# Altium schematic sheet MCU009B_ADC.SchDoc: ADC
size 431 x 279 mm; Date: Not shown in title block; ApprovedBy: Not shown in title block; CheckedBy: Not shown in title block; Author: Not shown in title block; CompanyName: Not shown in title block; Engineer: Not shown in title block; Organization: Not shown in title block; Address1: Not shown in title block; Address2: Not shown in title block; Address3: Not shown in title block; Address4: Not shown in title block; DocumentNumber: 4; Revision: Use project parameter SCH_Rev; SheetNumber: 4; SheetTotal: 7; PageSetup: Record=PageOptions|CenterHorizontal=True|CenterVertical=True|PrintScale=1.00|XCorrection=1.00|YCorrection=1.00|PrintKind=0|BorderSize=5000000|LeftOffset=0|BottomOffset=0|Orientation=2|PaperLength=1000|PaperWidth=1000|Scale=100|PaperSource=15|PrintQuality=600|MediaType=1|DitherType=10|PaperKind=Letter|PrintScaleMode=1; CurrentTime: Not shown in title block; CurrentDate: Not shown in title block; Time: Not shown in title block; DocumentFullPathAndName: Not shown in title block; DocumentName: Not shown in title block; ModifiedDate: Not shown in title block; ImagePath: Not shown in title block
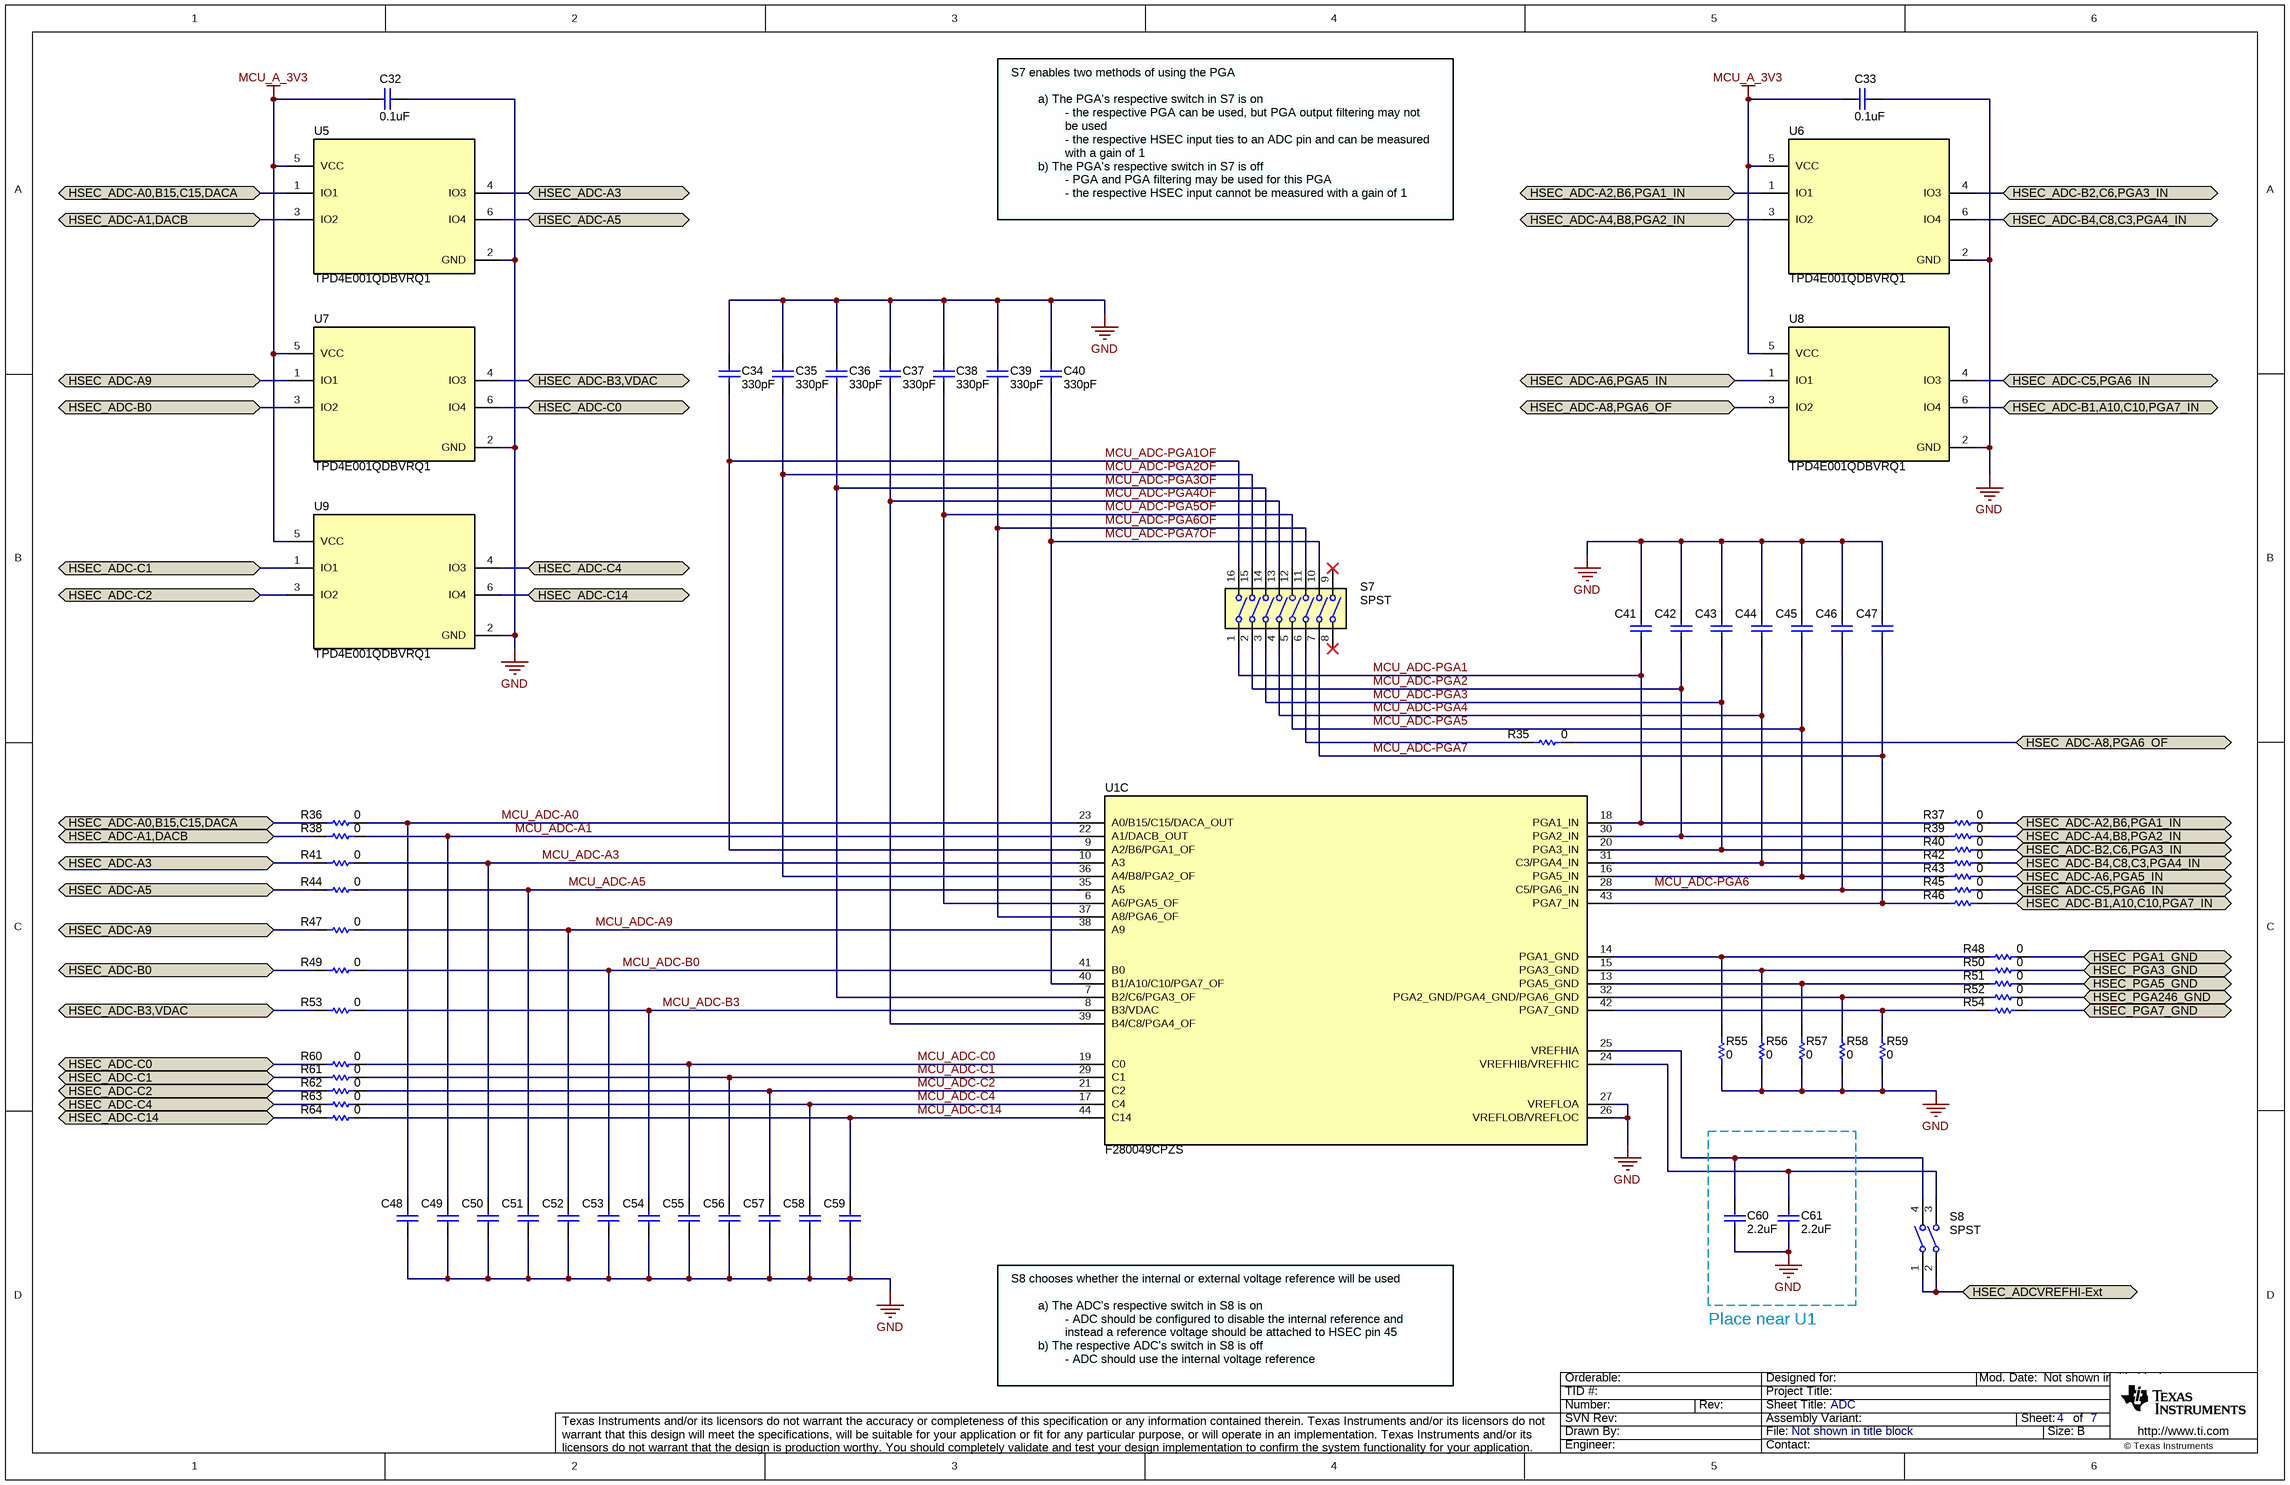
[diagram p0: MCU009B_ADC.SchDoc]

## Parts
C32  ValueDisplayed: 0.1uF  [0402]  (hidden comment: GRM155R71A104KA01D)
C33  ValueDisplayed: 0.1uF  [0402]  (hidden comment: GRM155R71A104KA01D)
C34  ValueDisplayed: 330pF  [0603]  (hidden comment: GRM1885C1H331JA01D)
C35  ValueDisplayed: 330pF  [0603]  (hidden comment: GRM1885C1H331JA01D)
C36  ValueDisplayed: 330pF  [0603]  (hidden comment: GRM1885C1H331JA01D)
C37  ValueDisplayed: 330pF  [0603]  (hidden comment: GRM1885C1H331JA01D)
C38  ValueDisplayed: 330pF  [0603]  (hidden comment: GRM1885C1H331JA01D)
C39  ValueDisplayed: 330pF  [0603]  (hidden comment: GRM1885C1H331JA01D)
C40  ValueDisplayed: 330pF  [0603]  (hidden comment: GRM1885C1H331JA01D)
C41  GRM188R71C104KA01D  [0603]  (value not drawn)
C42  GRM188R71C104KA01D  [0603]  (value not drawn)
C43  GRM188R71C104KA01D  [0603]  (value not drawn)
C44  GRM188R71C104KA01D  [0603]  (value not drawn)
C45  GRM188R71C104KA01D  [0603]  (value not drawn)
C46  GRM188R71C104KA01D  [0603]  (value not drawn)
C47  GRM188R71C104KA01D  [0603]  (value not drawn)
C48  GRM188R71C104KA01D  [0603]  (value not drawn)
C49  GRM188R71C104KA01D  [0603]  (value not drawn)
C50  GRM188R71C104KA01D  [0603]  (value not drawn)
C51  GRM188R71C104KA01D  [0603]  (value not drawn)
C52  GRM188R71C104KA01D  [0603]  (value not drawn)
C53  GRM188R71C104KA01D  [0603]  (value not drawn)
C54  GRM188R71C104KA01D  [0603]  (value not drawn)
C55  GRM188R71C104KA01D  [0603]  (value not drawn)
C56  GRM188R71C104KA01D  [0603]  (value not drawn)
C57  GRM188R71C104KA01D  [0603]  (value not drawn)
C58  GRM188R71C104KA01D  [0603]  (value not drawn)
C59  GRM188R71C104KA01D  [0603]  (value not drawn)
C60  ValueDisplayed: 2.2uF  [0603]  (hidden comment: GRM188R61A225KE34D)
C61  ValueDisplayed: 2.2uF  [0603]  (hidden comment: GRM188R61A225KE34D)
R35  ValueDisplayed: 0  [0603]  (hidden comment: CRCW06030000Z0EA)
R36  ValueDisplayed: 0  [0603]  (hidden comment: CRCW06030000Z0EA)
R37  ValueDisplayed: 0  [0603]  (hidden comment: CRCW06030000Z0EA)
R38  ValueDisplayed: 0  [0603]  (hidden comment: CRCW06030000Z0EA)
R39  ValueDisplayed: 0  [0603]  (hidden comment: CRCW06030000Z0EA)
R40  ValueDisplayed: 0  [0603]  (hidden comment: CRCW06030000Z0EA)
R41  ValueDisplayed: 0  [0603]  (hidden comment: CRCW06030000Z0EA)
R42  ValueDisplayed: 0  [0603]  (hidden comment: CRCW06030000Z0EA)
R43  ValueDisplayed: 0  [0603]  (hidden comment: CRCW06030000Z0EA)
R44  ValueDisplayed: 0  [0603]  (hidden comment: CRCW06030000Z0EA)
R45  ValueDisplayed: 0  [0603]  (hidden comment: CRCW06030000Z0EA)
R46  ValueDisplayed: 0  [0603]  (hidden comment: CRCW06030000Z0EA)
R47  ValueDisplayed: 0  [0603]  (hidden comment: CRCW06030000Z0EA)
R48  ValueDisplayed: 0  [0603]  (hidden comment: CRCW06030000Z0EA)
R49  ValueDisplayed: 0  [0603]  (hidden comment: CRCW06030000Z0EA)
R50  ValueDisplayed: 0  [0603]  (hidden comment: CRCW06030000Z0EA)
R51  ValueDisplayed: 0  [0603]  (hidden comment: CRCW06030000Z0EA)
R52  ValueDisplayed: 0  [0603]  (hidden comment: CRCW06030000Z0EA)
R53  ValueDisplayed: 0  [0603]  (hidden comment: CRCW06030000Z0EA)
R54  ValueDisplayed: 0  [0603]  (hidden comment: CRCW06030000Z0EA)
R55  ValueDisplayed: 0  [0603]  (hidden comment: CRCW06030000Z0EA)
R56  ValueDisplayed: 0  [0603]  (hidden comment: CRCW06030000Z0EA)
R57  ValueDisplayed: 0  [0603]  (hidden comment: CRCW06030000Z0EA)
R58  ValueDisplayed: 0  [0603]  (hidden comment: CRCW06030000Z0EA)
R59  ValueDisplayed: 0  [0603]  (hidden comment: CRCW06030000Z0EA)
R60  ValueDisplayed: 0  [0603]  (hidden comment: CRCW06030000Z0EA)
R61  ValueDisplayed: 0  [0603]  (hidden comment: CRCW06030000Z0EA)
R62  ValueDisplayed: 0  [0603]  (hidden comment: CRCW06030000Z0EA)
R63  ValueDisplayed: 0  [0603]  (hidden comment: CRCW06030000Z0EA)
R64  ValueDisplayed: 0  [0603]  (hidden comment: CRCW06030000Z0EA)
S7  Circuit: SPST  [SW_218-8LP]  (hidden comment: 218-8LPST)
S8  Circuit: SPST  [SW_218-2LP]  (hidden comment: 218-2LPST)
U1  F280049CPZS  [PZ0100A_N]  (part C of 5)
U5  TPD4E001QDBVRQ1  [DBV0006A_N]
U6  TPD4E001QDBVRQ1  [DBV0006A_N]
U7  TPD4E001QDBVRQ1  [DBV0006A_N]
U8  TPD4E001QDBVRQ1  [DBV0006A_N]
U9  TPD4E001QDBVRQ1  [DBV0006A_N]

## Ports
HSEC_ADC-A0,B15,C15,DACA (bidir), HSEC_ADC-A1,DACB (bidir), HSEC_ADC-A2,B6,PGA1_IN (bidir), HSEC_ADC-A3 (bidir), HSEC_ADC-A4,B8,PGA2_IN (bidir), HSEC_ADC-A5 (bidir), HSEC_ADC-A6,PGA5_IN (bidir), HSEC_ADC-A8,PGA6_OF (bidir), HSEC_ADC-A9 (bidir), HSEC_ADC-B0 (bidir), HSEC_ADC-B1,A10,C10,PGA7_IN (bidir), HSEC_ADC-B2,C6,PGA3_IN (bidir), HSEC_ADC-B3,VDAC (bidir), HSEC_ADC-B4,C8,C3,PGA4_IN (bidir), HSEC_ADC-C0 (bidir), HSEC_ADC-C1 (bidir), HSEC_ADC-C2 (bidir), HSEC_ADC-C4 (bidir), HSEC_ADC-C5,PGA6_IN (bidir), HSEC_ADC-C14 (bidir), HSEC_ADCVREFHI-Ext (bidir), HSEC_PGA1_GND (bidir), HSEC_PGA3_GND (bidir), HSEC_PGA5_GND (bidir), HSEC_PGA7_GND (bidir), HSEC_PGA246_GND (bidir)

## Nets
GND: C32.2 C33.2 C34.1 C35.1 C36.1 C37.1 C38.1 C39.1 C40.1 C41.1 C42.1 C43.1 C44.1 C45.1 C46.1 C47.1 C48.2 C49.2 C50.2 C51.2 C52.2 C53.2 C54.2 C55.2 C56.2 C57.2 C58.2 C59.2 C60.1 C61.1 R55.1 R56.1 R57.1 R58.1 R59.1 U1.26(VREFLOB/VREFLOC) U1.27(VREFLOA) U5.2(GND) U6.2(GND) U7.2(GND) U8.2(GND) U9.2(GND)
MCU_A_3V3: C32.1 C33.1 U5.5(VCC) U6.5(VCC) U7.5(VCC) U8.5(VCC) U9.5(VCC)
HSEC_ADC-A0,B15,C15,DACA: R36.2 U5.1(IO1) ; port HSEC_ADC-A0,B15,C15,DACA
HSEC_ADC-A1,DACB: R38.2 U5.3(IO2) ; port HSEC_ADC-A1,DACB
HSEC_ADC-A2,B6,PGA1_IN: R37.1 U6.1(IO1) ; port HSEC_ADC-A2,B6,PGA1_IN
HSEC_ADC-A3: R41.2 U5.4(IO3) ; port HSEC_ADC-A3
HSEC_ADC-A4,B8,PGA2_IN: R39.1 U6.3(IO2) ; port HSEC_ADC-A4,B8,PGA2_IN
HSEC_ADC-A5: R44.2 U5.6(IO4) ; port HSEC_ADC-A5
HSEC_ADC-A6,PGA5_IN: R43.1 U8.1(IO1) ; port HSEC_ADC-A6,PGA5_IN
HSEC_ADC-A8,PGA6_OF: R35.1 U8.3(IO2) ; port HSEC_ADC-A8,PGA6_OF
HSEC_ADC-A9: R47.2 U7.1(IO1) ; port HSEC_ADC-A9
HSEC_ADC-B0: R49.2 U7.3(IO2) ; port HSEC_ADC-B0
HSEC_ADC-B1,A10,C10,PGA7_IN: R46.1 U8.6(IO4) ; port HSEC_ADC-B1,A10,C10,PGA7_IN
HSEC_ADC-B2,C6,PGA3_IN: R40.1 U6.4(IO3) ; port HSEC_ADC-B2,C6,PGA3_IN
HSEC_ADC-B3,VDAC: R53.2 U7.4(IO3) ; port HSEC_ADC-B3,VDAC
HSEC_ADC-B4,C8,C3,PGA4_IN: R42.1 U6.6(IO4) ; port HSEC_ADC-B4,C8,C3,PGA4_IN
HSEC_ADC-C0: R60.2 U7.6(IO4) ; port HSEC_ADC-C0
HSEC_ADC-C1: R61.2 U9.1(IO1) ; port HSEC_ADC-C1
HSEC_ADC-C2: R62.2 U9.3(IO2) ; port HSEC_ADC-C2
HSEC_ADC-C4: R63.2 U9.4(IO3) ; port HSEC_ADC-C4
HSEC_ADC-C5,PGA6_IN: R45.1 U8.4(IO3) ; port HSEC_ADC-C5,PGA6_IN
HSEC_ADC-C14: R64.2 U9.6(IO4) ; port HSEC_ADC-C14
HSEC_ADCVREFHI-Ext: S8.1 S8.2 ; port HSEC_ADCVREFHI-Ext
HSEC_PGA1_GND: R48.1 ; port HSEC_PGA1_GND
HSEC_PGA3_GND: R50.1 ; port HSEC_PGA3_GND
HSEC_PGA5_GND: R51.1 ; port HSEC_PGA5_GND
HSEC_PGA7_GND: R54.1 ; port HSEC_PGA7_GND
HSEC_PGA246_GND: R52.1 ; port HSEC_PGA246_GND
MCU_ADC-A0: C48.1 R36.1 U1.23(A0/B15/C15/DACA_OUT)
MCU_ADC-A1: C49.1 R38.1 U1.22(A1/DACB_OUT)
MCU_ADC-A3: C50.1 R41.1 U1.10(A3)
MCU_ADC-A5: C51.1 R44.1 U1.35(A5)
MCU_ADC-A9: C52.1 R47.1 U1.38(A9)
MCU_ADC-B0: C53.1 R49.1 U1.41(B0)
MCU_ADC-B3: C54.1 R53.1 U1.8(B3/VDAC)
MCU_ADC-C0: C55.1 R60.1 U1.19(C0)
MCU_ADC-C1: C56.1 R61.1 U1.29(C1)
MCU_ADC-C2: C57.1 R62.1 U1.21(C2)
MCU_ADC-C4: C58.1 R63.1 U1.17(C4)
MCU_ADC-C14: C59.1 R64.1 U1.44(C14)
MCU_ADC-PGA1: C41.2 R37.2 S7.1 U1.18(PGA1_IN)
MCU_ADC-PGA1OF: C34.2 S7.16(1A) U1.9(A2/B6/PGA1_OF)
MCU_ADC-PGA2: C42.2 R39.2 S7.2 U1.30(PGA2_IN)
MCU_ADC-PGA2OF: C35.2 S7.15(2A) U1.36(A4/B8/PGA2_OF)
MCU_ADC-PGA3: C43.2 R40.2 S7.3 U1.20(PGA3_IN)
MCU_ADC-PGA3OF: C36.2 S7.14(3A) U1.7(B2/C6/PGA3_OF)
MCU_ADC-PGA4: C44.2 R42.2 S7.4 U1.31(C3/PGA4_IN)
MCU_ADC-PGA4OF: C37.2 S7.13(4A) U1.39(B4/C8/PGA4_OF)
MCU_ADC-PGA5: C45.2 R43.2 S7.5 U1.16(PGA5_IN)
MCU_ADC-PGA5OF: C38.2 S7.12(5A) U1.6(A6/PGA5_OF)
MCU_ADC-PGA6: C46.2 R45.2 U1.28(C5/PGA6_IN)
MCU_ADC-PGA6OF: C39.2 S7.11(6A) U1.37(A8/PGA6_OF)
MCU_ADC-PGA7: C47.2 R46.2 S7.7 U1.43(PGA7_IN)
MCU_ADC-PGA7OF: C40.2 S7.10(7A) U1.40(B1/A10/C10/PGA7_OF)
NetC60_2: C60.2 S8.4 U1.25(VREFHIA)
NetC61_2: C61.2 S8.3 U1.24(VREFHIB/VREFHIC)
NetR35_2: R35.2 S7.6
NetR48_2: R48.2 R55.2 U1.14(PGA1_GND)
NetR50_2: R50.2 R56.2 U1.15(PGA3_GND)
NetR51_2: R51.2 R57.2 U1.13(PGA5_GND)
NetR52_2: R52.2 R58.2 U1.32(PGA2_GND/PGA4_GND/PGA6_GND)
NetR54_2: R54.2 R59.2 U1.42(PGA7_GND)

Not connected (* = marked no-connect by the designer): S7 8* 9(8A)*

## Notes on the sheet
- S7 enables two methods of using the PGA
- a) The PGA's respective switch in S7 is on
- b) The PGA's respective switch in S7 is off
- - the respective HSEC input ties to an ADC pin and can be measured
- - the respective PGA can be used, but PGA output filtering may not
- with a gain of 1
- be used
- - PGA and PGA filtering may be used for this PGA
- - the respective HSEC input cannot be measured with a gain of 1
- S8 chooses whether the internal or external voltage reference will be used
- a) The ADC's respective switch in S8 is on
- b) The respective ADC's switch in S8 is off
- - ADC should be configured to disable the internal reference and
- - ADC should use the internal voltage reference
- instead a reference voltage should be attached to HSEC pin 45
- Place near U1
- Drawn By:
- SVN Rev:
- Number:
- TID #:
- Orderable:
- Rev:
- Sheet Title:
- File:
- Project Title:
- Designed for:
- Assembly Variant:
- Mod. Date:
- Sheet:
- Size:
- of
- B
- http://www.ti.com
- Texas Instruments and/or its licensors do not warrant the accuracy or completeness of this specification or any information contained therein. Texas Instruments and/or its licensors do not warrant that this design will meet the specifications, will be suitable for your application or fit for any particular purpose, or will operate in an implementation. Texas Instruments and/or its licensors do not warrant that the design is production worthy. You should completely validate and test your design implementation to confirm the system functionality for your application.
- Engineer:
- Contact:
- © Texas Instruments

## Library data of the parts
C32 C33 = CMP-0006629-2: CAP, CERM, 0.1 uF, 10 V, +/- 10%, X7R, 0402; Manufacturer: MuRata; Polarized: N; Value: 0.1uF; U/M: EA; Cap_F: 100nF; Value1: Unknown; VDC_V: 10V; TaMin_C: -55°C; TaMax_C: 125°C; AEC Category: Q200; SizeArea_mm2: 0.5; SizeAreaWB_mm2: 3; SizeX_mm: 1; SizeZ_mm: 0.6; CompType: Capacitor; PartNumber: GRM155R71A104KA01D; PackageReference: 0402; RoHS: Y; Tolerance_%: 10%; Value2: 10V; MountType: SMT; Technology: Ceramic; TempCo: X7R; Cap_Case: 0402; Published: 2008-06-19; Publisher: Texas Instruments; LatestRevisionDate: 2017-03-09; ComponentLink1Description: Datasheet link; ComponentLink1URL: http://search.murata.co.jp/Ceramy/PnsearchViewAction.do?HnOFG=ON&HnNFG=ON&SEL_CNT=50&sLang=en&sKey=GRM155R71A104KA01D&x=9&y=9&search=startwith; Supplier 1: Digi-Key; Supplier Part Number 1: GRM155R71A104KA01D-ND; Supplier 2: Newark; Supplier Part Number 2: 14T3278; Supplier 3: Mouser; Supplier Part Number 3: 81-GRM155R71A104KA1D; AEC Qualified: ?; SizeY_mm: 0.5
C34-C40 = CMP-0007209-4: CAP, CERM, 330 pF, 50 V, +/- 5%, C0G/NP0, 0603; Manufacturer: MuRata; Polarized: N; Value: 330pF; U/M: EA; Value1: Unknown; VDC_V: 50V; TaMin_C: -55°C; TaMax_C: 125°C; SizeArea_mm2: 1.28; SizeAreaWB_mm2: 4.68; SizeX_mm: 1.6; SizeY_mm: 0.8; SizeZ_mm: 1; AEC Category: Q200; CompType: Capacitor; PartNumber: GRM1885C1H331JA01D; PackageReference: 0603; RoHS: Y; Cap_F: 330pF; Tolerance_%: 5%; Value2: 50V; MountType: SMT; Technology: Ceramic; TempCo: C0G/NP0; Cap_Case: 0603; Published: 2008-06-19; Publisher: Texas Instruments; LatestRevisionDate: 2017-03-09; ComponentLink1Description: Datasheet link; ComponentLink1URL: http://search.murata.co.jp/Ceramy/PnsearchViewAction.do?HnOFG=ON&HnNFG=ON&SEL_CNT=50&sLang=en&sKey=GRM1885C1H331JA01D&x=9&y=9&search=startwith; Supplier 1: Digi-Key; Supplier Part Number 1: 490-1439-1-ND; Supplier 2: Mouser; Supplier Part Number 2: 81-GRM39C331J50; Supplier 3: Farnell; Supplier Part Number 3: 8819890; AEC Qualified: ?
C41-C54 C56-C59 = CMP-0007378-5: CAP, CERM, 0.1 uF, 16 V, +/- 10%, X7R, 0603; Manufacturer: MuRata; Polarized: N; Value: 0.1uF; U/M: EA; Cap_F: 100nF; Value1: Unknown; VDC_V: 16V; TaMin_C: -55°C; TaMax_C: 125°C; SizeArea_mm2: 1.28; SizeAreaWB_mm2: 4.68; SizeX_mm: 1.6; SizeY_mm: 0.8; SizeZ_mm: 1; AEC Category: Q200; CompType: Capacitor; PartNumber: GRM188R71C104KA01D; ValueDisplayed: 0.1uF; PackageReference: 0603; RoHS: Y; Tolerance_%: 10%; Value2: 16V; MountType: SMT; Technology: Ceramic; TempCo: X7R; Cap_Case: 0603; Published: 2008-06-19; Publisher: Texas Instruments; LatestRevisionDate: 2017-03-09; ComponentLink1Description: Datasheet link; ComponentLink1URL: http://search.murata.co.jp/Ceramy/PnsearchViewAction.do?HnOFG=ON&HnNFG=ON&SEL_CNT=50&sLang=en&sKey=GRM188R71C104KA01D&x=9&y=9&search=startwith; Supplier 1: Digi-Key; Supplier Part Number 1: 490-1532-1-ND; Supplier 2: Mouser; Supplier Part Number 2: 81-GRM39X104K16; Supplier 3: Farnell; Supplier Part Number 3: 1828890; AEC Qualified: ?
C55 = CMP-0007378-5: CAP, CERM, 0.1 uF, 16 V, +/- 10%, X7R, 0603; Manufacturer: MuRata; Polarized: N; CompType: Capacitor; Value: 0.1uF; U/M: EA; Cap_F: 100nF; Value1: Unknown; VDC_V: 16V; TaMin_C: -55°C; TaMax_C: 125°C; SizeArea_mm2: 1.28; SizeAreaWB_mm2: 4.68; SizeX_mm: 1.6; SizeY_mm: 0.8; SizeZ_mm: 1; AEC Category: Q200; PartNumber: GRM188R71C104KA01D; ValueDisplayed: 0.1uF; PackageReference: 0603; RoHS: Y; Tolerance_%: 10%; Value2: 16V; MountType: SMT; Technology: Ceramic; TempCo: X7R; Cap_Case: 0603; Published: 2008-06-19; Publisher: Texas Instruments; LatestRevisionDate: 2017-03-09; ComponentLink1Description: Datasheet link; ComponentLink1URL: http://search.murata.co.jp/Ceramy/PnsearchViewAction.do?HnOFG=ON&HnNFG=ON&SEL_CNT=50&sLang=en&sKey=GRM188R71C104KA01D&x=9&y=9&search=startwith; Supplier 1: Digi-Key; Supplier Part Number 1: 490-1532-1-ND; Supplier 2: Mouser; Supplier Part Number 2: 81-GRM39X104K16; Supplier 3: Farnell; Supplier Part Number 3: 1828890; AEC Qualified: ?
C60 C61 = CMP-0007323-5: CAP, CERM, 2.2 uF, 10 V, +/- 10%, X5R, 0603; Manufacturer: MuRata; Polarized: N; Value: 2.2uF; U/M: EA; Cap_F: 2.2µF; Value1: Unknown; VDC_V: 10V; TaMin_C: -55°C; TaMax_C: 85°C; AEC Category: Q200; SizeArea_mm2: 1.28; SizeAreaWB_mm2: 4.68; SizeX_mm: 1.6; SizeY_mm: 0.8; SizeZ_mm: 1; CompType: Capacitor; PartNumber: GRM188R61A225KE34D; PackageReference: 0603; RoHS: Y; Tolerance_%: 10%; Value2: 10V; MountType: SMT; Technology: Ceramic; TempCo: X5R; Cap_Case: 0603; Published: 2008-06-19; Publisher: Texas Instruments; LatestRevisionDate: 2017-03-09; ComponentLink1Description: Datasheet link; ComponentLink1URL: http://search.murata.co.jp/Ceramy/PnsearchViewAction.do?HnOFG=ON&HnNFG=ON&SEL_CNT=50&sLang=en&sKey=GRM188R61A225KE34D&x=9&y=9&search=startwith; Supplier 1: Digi-Key; Supplier Part Number 1: 490-1545-1-ND; Supplier 2: Mouser; Supplier Part Number 2: 81-GRM188R61A225KE34; Supplier 3: Farnell; Supplier Part Number 3: 1828799; AEC Qualified: ?
R35-R64 = CMP-0025697-4: RES, 0, 5%, 0.1 W, AEC-Q200 Grade 0, 0603; Manufacturer: Vishay-Dale; Value: 0; Value_Code: 0000; Power_W: 100mW; Value2: 0.1W; VDC_V: 75V; TempCo: 200 ppm/C; EIA_Code: E24; AEC Category: Q200; AEC Qualified: Y; SizeArea_mm2: 1.28; SizeX_mm: 1.6; SizeY_mm: 0.8; SizeZ_mm: 1; CompType: Resistor; PartNumber: CRCW06030000Z0EA; PackageReference: 0603; RoHS: E; Res_ohm: 0; Tolerance_%: 5%; Value1: 5%; MountType: SMT; Technology: Thick Film; ComponentLink1Description: Datasheet link; ComponentLink1URL: http://www.vishay.com/docs/20035/dcrcwe3.pdf; Supplier 1: Digi-Key; Supplier Part Number 1: 541-0.0GCT-ND; Supplier 2: Newark; Supplier Part Number 2: 52K8014; Supplier 3: Mouser; Supplier Part Number 3: 71-CRCW0603-0-E3; AEC Grade: 0
S7 = CMP-0002229-1: Switch, SPST, 8 Pos, 25mA, 24VDC, SMD; Manufacturer: CTS Electrocomponents; VDC_V: 24V; SwitchFunction: Off-On; PositionCount: 8; CurrentRating_mA: 25A; PartNumber: 218-8LPST; MountType: SMT; ComponentLink1Description: Datasheet Link; ComponentLink1URL: http://www.ctscorp.com/components/Datasheets/218.pdf; RoHS: Y; Orientation: Top Actuated; CompType: Switch; PackageReference: 11.33x5.8mm; Publisher: Texas Instruments; LatestRevisionDate: 2017-03-09; Supplier 1: Digi-Key; Supplier Part Number 1: CT2188LPST-ND; Supplier 2: Mouser; Supplier Part Number 2: 774-2188LPST
S8 = CMP-0002230-1: Switch, SPST, 2 Pos, 25mA, 24VDC, SMD; Manufacturer: CTS Electrocomponents; VDC_V: 24V; SwitchFunction: Off-On; PositionCount: 2; CurrentRating_mA: 25A; PartNumber: 218-2LPST; MountType: SMT; ComponentLink1Description: Datasheet Link; ComponentLink1URL: http://www.ctscorp.com/components/Datasheets/218.pdf; RoHS: Y; Orientation: Top Actuated; CompType: Switch; PackageReference: 3.71x5.8mm; Publisher: Texas Instruments; LatestRevisionDate: 2017-03-09; Supplier 1: Digi-Key; Supplier Part Number 1: CT2182LPST-ND; Supplier 2: Mouser; Supplier Part Number 2: 774-2182LPST
U1 = CMP-0078352-1: Piccolo Microcontroller, PZ0100A (LQFP-100); Manufacturer: Texas Instruments; SizeArea_mm2: 256; SizeAreaWB_mm2: 324; SizeX_mm: 16; SizeZ_mm: 1.6; CompType: IC; AEC Category: Q200; AEC Qualified: N; PartNumber: F280049CPZS; PackageReference: PZ0100A; PackageDescription: LQFP-100; MountType: SMT; SizeY_mm: 16; ComponentLink1Description: Datasheet Link; ComponentLink1URL: http://www.ti.com/lit/ds/symlink/tms320f280049c.pdf; Alternate Manufacturer: Texas Instruments; ComponentLink2URL: http://www.ti.com/product/tms320f280049c; ComponentLink2Description: Product Folder
U5-U9 = CMP-0066599-1: Automotive Low-Capacitance 4-Channel +/-15-kV ESD Protection Array for High-Speed Data Interfaces, DBV0006A (SOT-23-6); Manufacturer: Texas Instruments; CompType: IC; U/M: EA; SizeArea_mm2: 8.12; SizeAreaWB_mm2: 14.82; SizeX_mm: 2.8; SizeY_mm: 2.9; SizeZ_mm: 1.45; PartNumber: TPD4E001QDBVRQ1; PackageReference: DBV0006A; MountType: SMT; ComponentLink1Description: Datasheet Link; ComponentLink1URL: http://www.ti.com/lit/ds/symlink/tpd4e001-q1.pdf; RoHS: Y; Publisher: Texas Instruments; LatestRevisionDate: 2017-06-09; Alternate Manufacturer: Texas Instruments; PackageDescription: SOT-23-6; Footprint Path 6: C:\AltiumLibraries\Footprints\TI\.PcbLib